# EasyEDA schematic EasyEDA_SCH_ESPHome_Inverter_2341.json
TITLE: ESPHome Inverter 2341; REV: 1.0; Date: 2024-09-06; Sheet: 1/1
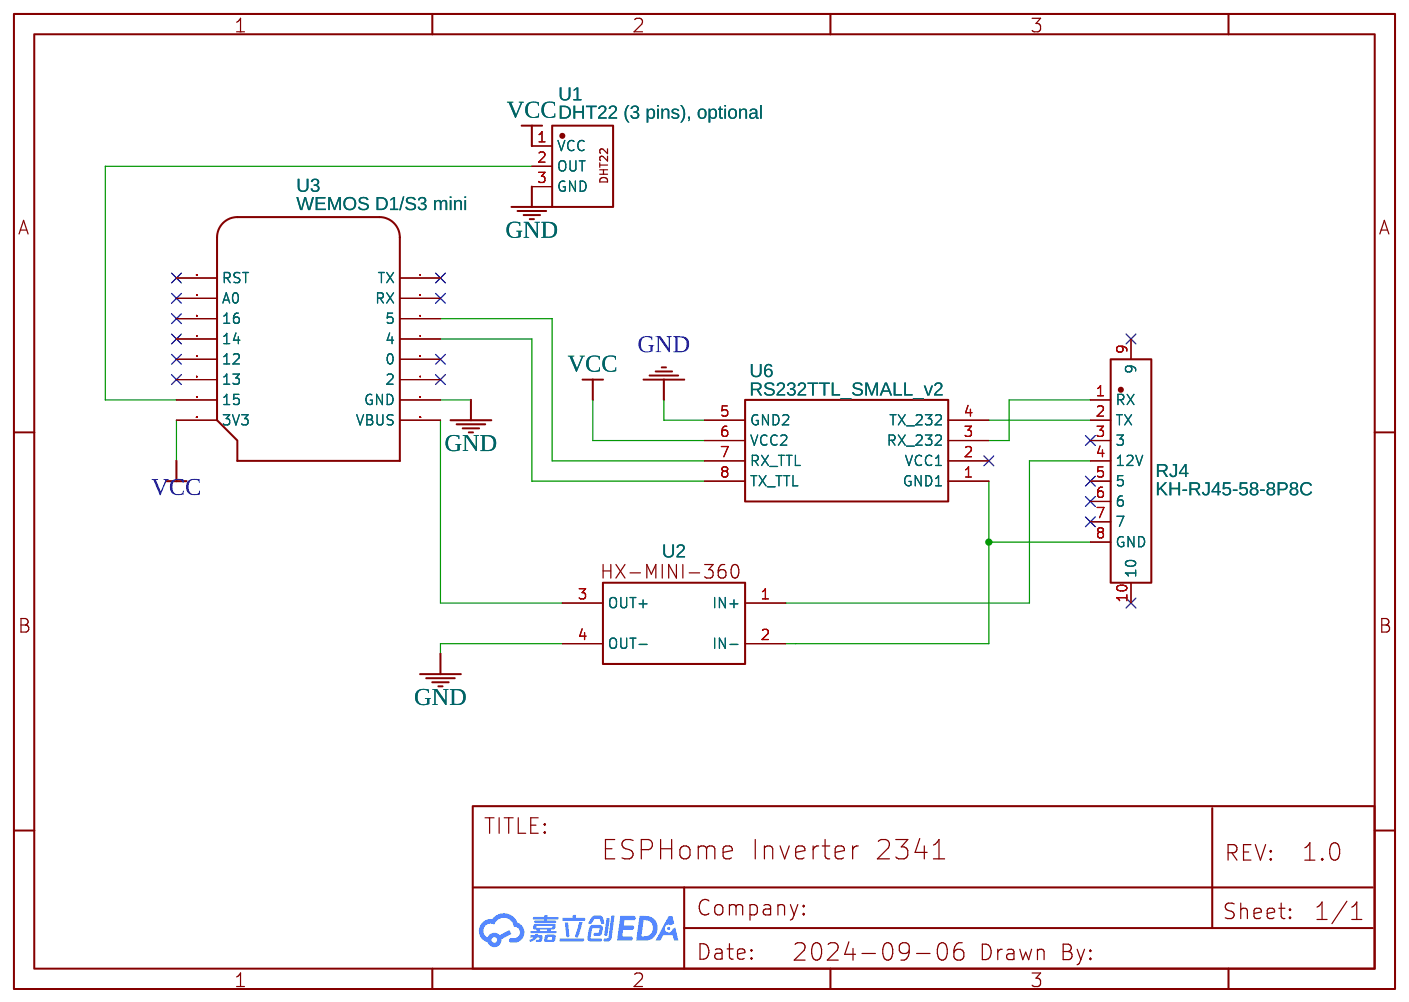
[diagram p0: schematic sheet]

## Parts
RJ4  KH-RJ45-58-8P8C  [RJ45-TH_KH-RJ45-58-8P8C]
U1  DHT22 (3 pins), optional  [SENSOR-TH_HAIGU_DHT22]
U2  HX-MINI-360 Module  [HX-MINI-360 MODULE]
U3  WEMOS D1/S3 mini  [WEMOS D1 V4 FP]
U6  RS232TTL_SMALL_v2  [RS232TTL_SMALL]

## Library data of the parts
RJ4 = KH-RJ45-58-8P8C: Contributor: LCSC; Supplier: LCSC; Supplier Part: C2683360; Manufacturer: kinghelm(金航标); JLCPCB Part Class: Extended Part; link: https://lcsc.com/eda_search?q=C2683360&%26type=1&ref=editor
U1 = DHT22 Modulo (3 pinos): Supplier: Curto-circuito; Supplier Part: C2880291; Manufacturer: ASAIR AM2302; Manufacturer Part: DHT22 Modulo; Contributor: mrpcb2015; JLCPCB Part Class: Extended Part
U2 = HX-MINI-360 Module: link: https://cdn.solarbotics.com/products/datasheets/mp2307.pdf; Contributor: 160205vl
U3 = WEMOS D1 V4: Manufacturer Part: WeMos D1 Mini Pro; Supplier Part: undefined; Contributor: Alexus-12
U6 = RS232TTL_SMALL_v2: Supplier: BANGGOOD; Contributor: Andrey Ganzevich

## Nets
GND: U1.3(GND) U2.4(OUT-) U3.GND U6.5(GND2)
VCC: U1.1(VCC) U3.3V3 U6.6(VCC2)
Net-(RJ4-1): RJ4.1(RX) U6.3(RX 232)
Net-(RJ4-2): RJ4.2(TX) U6.4(TX 232)
Net-(RJ4-4): RJ4.4(12V) U2.1(IN+)
Net-(RJ4-8): RJ4.8(GND) U2.2(IN-) U6.1(GND1)
Net-(U1-2): U1.2(OUT) U3.15
Net-(U2-3): U2.3(OUT+) U3.VBUS
Net-(U3-4): U3.4 U6.8(TX TTL)
Net-(U3-5): U3.5 U6.7(RX TTL)

Not connected (* = marked no-connect by the designer): RJ4 3* 5* 6* 7* 9* 10*; U3 0* 2* 12* 13* 14* 16* A0* RST* RX* TX*; U6 2(VCC1)*
